# Altium project FlightController.PrjPcb (part 2 of 2)

## Sheet NRF24l01.SchDoc
size A2; SheetNumber: 5; SheetTotal: 13
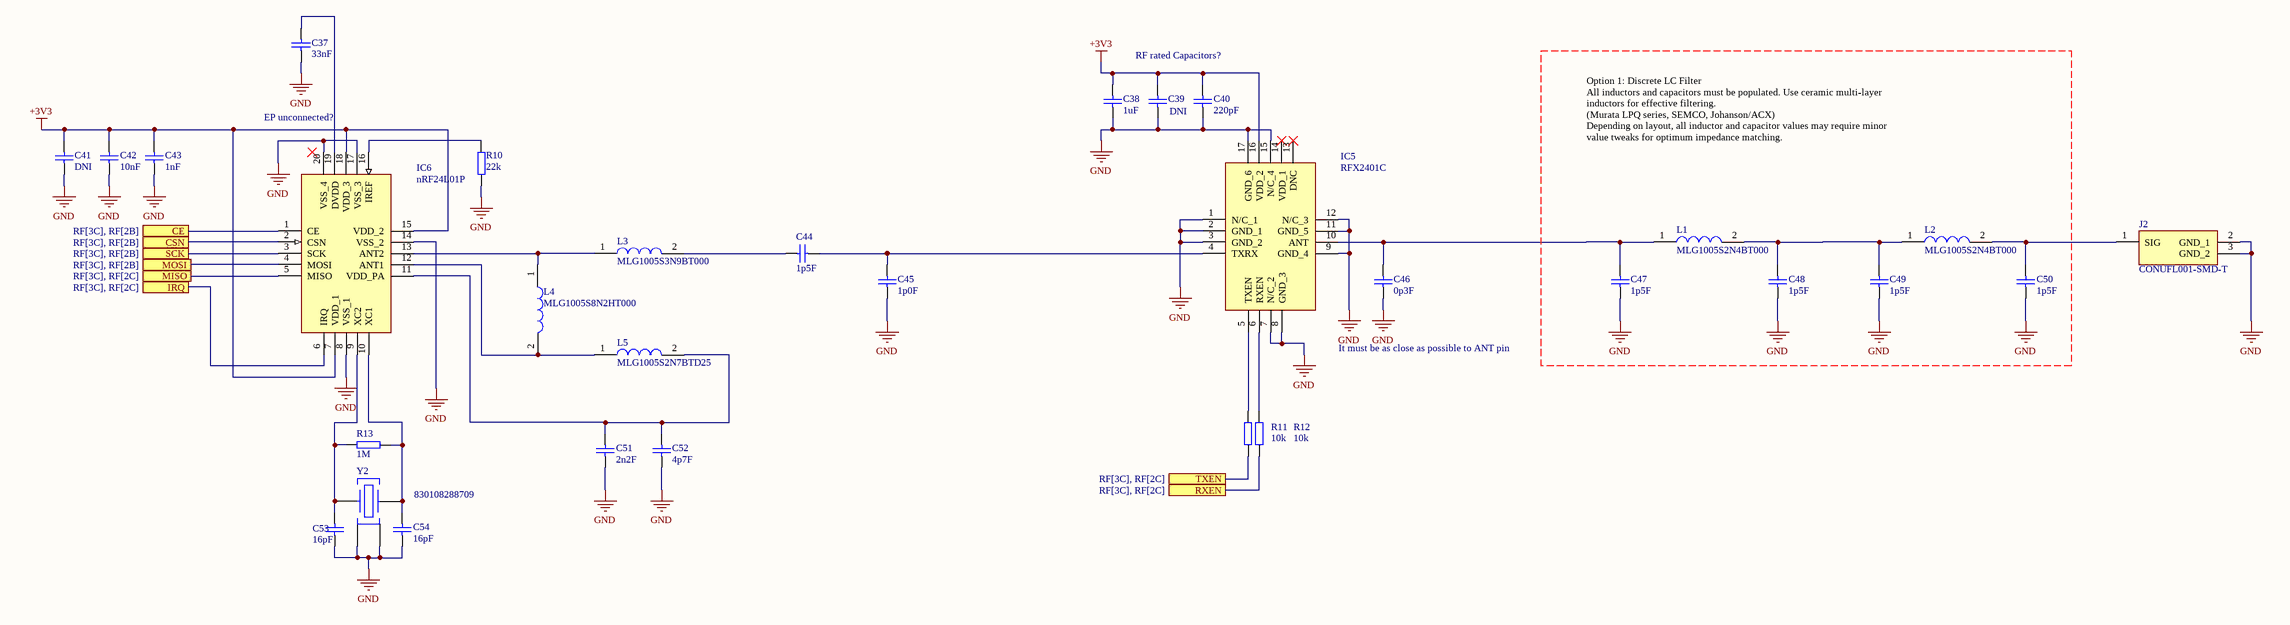
[diagram p11: NRF24l01.SchDoc]

### Parts
C37  value 33nF  [CAP0402]  (hidden comment: Cap0402)
C38  value 1uF  [CAP0402]  (hidden comment: Cap0402)
C39  value DNI  [CAP0402]  (hidden comment: Cap0402)
C40  value 220pF  [CAP0402]  (hidden comment: Cap0402)
C41  value DNI  [CAP0402]  (hidden comment: Cap0402)
C42  value 10nF  [CAP0402]  (hidden comment: Cap0402)
C43  value 1nF  [CAP0402]  (hidden comment: Cap0402)
C44  value 1p5F  [CAP0402]  (hidden comment: Cap0402)
C45  value 1p0F  [CAP0402]  (hidden comment: Cap0402)
C46  value 0p3F  [CAP0402]  (hidden comment: Cap0402)
C47  value 1p5F  [CAP0402]  (hidden comment: Cap0402)
C48  value 1p5F  [CAP0402]  (hidden comment: Cap0402)
C49  value 1p5F  [CAP0402]  (hidden comment: Cap0402)
C50  value 1p5F  [CAP0402]  (hidden comment: Cap0402)
C51  value 2n2F  [CAP0402]  (hidden comment: Cap0402)
C52  value 4p7F  [CAP0402]  (hidden comment: Cap0402)
C53  value 16pF  [CAP0402]  (hidden comment: Cap0402)
C54  value 16pF  [CAP0402]  (hidden comment: Cap0402)
IC5  RFX2401C  [QFN50P300X300X60-17N-D]
IC6  nRF24L01P  [QFN50P400X400X95-21N-D]
J2  CONUFL001-SMD-T  [CONUFL001-SMD]
L1  MLG1005S2N4BT000  [MLG1005]
L2  MLG1005S2N4BT000  [MLG1005]
L3  MLG1005S3N9BT000  [MLG1005]
L4  MLG1005S8N2HT000  [MLG1005]
L5  MLG1005S2N7BTD25  [MLG1005]
R10  value 22k  [RES0402]  (hidden comment: Res0402)
R11  value 10k  [RES0402]  (hidden comment: Res0402)
R12  value 10k  [RES0402]  (hidden comment: Res0402)
R13  value 1M  [RES0402]  (hidden comment: Res0402)
Y2  830108288709  [830108288709]

### Ports
CE (see RF[3C], RF[2B]), CSN (see RF[3C], RF[2B]), IRQ (see RF[3C], RF[2C]), MISO (see RF[3C], RF[2C]), MOSI (see RF[3C], RF[2B]), RXEN (see RF[3C], RF[2C]), SCK (see RF[3C], RF[2B]), TXEN (see RF[3C], RF[2C])

### Nets
+3V3: C38.2 C39.2 C40.2 C41.2 C42.2 C43.2 IC5.16(VDD_2) IC6.7(VDD_1) IC6.15(VDD_2) IC6.18(VDD_3)
GND: C37.1 C38.1 C39.1 C40.1 C41.1 C42.1 C43.1 C45.1 C46.1 C47.1 C48.1 C49.1 C50.1 C51.1 C52.1 C53.1 C54.1 IC5.1(N/C_1) IC5.2(GND_1) IC5.3(GND_2) IC5.7(N/C_2) IC5.8(GND_3) IC5.9(GND_4) IC5.11(GND_5) IC5.12(N/C_3) IC5.15(N/C_4) IC5.17(GND_6) IC6.8(VSS_1) IC6.14(VSS_2) IC6.17(VSS_3) IC6.20(VSS_4) J2.2(GND_1) J2.3(GND_2) R10.1 Y2.2(GND_1) Y2.4(GND_2)
NetC37_2: C37.2 IC6.19(DVDD)
NetC44_1: C44.1 C45.2 IC5.4(TXRX)
NetC44_2: C44.2 L3.2
NetC46_2: C46.2 C47.2 IC5.10(ANT) L1.1
NetC48_2: C48.2 C49.2 L1.2 L2.1
NetC50_2: C50.2 J2.1(SIG) L2.2
NetC51_2: C51.2 C52.2 IC6.11(VDD_PA) L5.2
NetC53_2: C53.2 IC6.9(XC2) R13.1 Y2.1(CRYSTAL_1)
NetC54_2: C54.2 IC6.10(XC1) R13.2 Y2.3(CRYSTAL_2)
NetIC5_5: IC5.5(TXEN) R11.2
NetIC5_6: IC5.6(RXEN) R12.2
NetIC6_1: IC6.1(CE) ; port CE
NetIC6_2: IC6.2(CSN) ; port CSN
NetIC6_3: IC6.3(SCK) ; port SCK
NetIC6_4: IC6.4(MOSI) ; port MOSI
NetIC6_5: IC6.5(MISO) ; port MISO
NetIC6_6: IC6.6(IRQ) ; port IRQ
NetIC6_12: IC6.12(ANT1) L4.2 L5.1
NetIC6_13: IC6.13(ANT2) L3.1 L4.1
NetIC6_16: IC6.16(IREF) R10.2
NetR11_1: R11.1 ; port TXEN
NetR12_1: R12.1 ; port RXEN

Not connected (* = marked no-connect by the designer): IC5 13(DNC)* 14(VDD_1)*

### Notes on the sheet
- RF rated Capacitors?
- EP unconnected?
- Option 1: Discrete LC Filter
  All inductors and capacitors must be populated. Use ceramic multi-layer
  inductors for effective filtering.
  (Murata LPQ series, SEMCO, Johanson/ACX)
  Depending on layout, all inductor and capacitor values may require minor
  value tweaks for optimum impedance matching.
- It must be as close as possible to ANT pin

### Library data of the parts
C37 = Cap0402: Manufacturer_Part_Number: GRM155R61H333KE14D; Voltage: 6V3
C38 = Cap0402: Manufacturer_Part_Number: GRM155R61H105KE05J; Voltage: 6V3
C39 C41 = Cap0402: Voltage: 6V3
C40 = Cap0402: Manufacturer_Part_Number: GRM1555C1H221JA01D; Voltage: 6V3
C42 = Cap0402: Manufacturer_Part_Number: GRM155R71H103MA88D; Voltage: 6V3
C43 = Cap0402: Manufacturer_Part_Number: GRM155R71H102KA01J; Voltage: 6V3
C44 C47-C50 = Cap0402: RF NP0; Manufacturer_Part_Number: GRM1555C1H1R5BA01J; Voltage: 6V3
C45 = Cap0402: RF NP0; Manufacturer_Part_Number: GCM1555C1H1R0BA16D; Voltage: 6V3
C46 = Cap0402: RF NP0; Manufacturer_Part_Number: GJM1555C1HR30BB01J; Voltage: 6V3
C51 = Cap0402: RF NP0; Manufacturer_Part_Number: GRM1555C1H222GA01D; Voltage: 6V3
C52 = Cap0402: RF NP0; Manufacturer_Part_Number: GJM1555C1H4R7CB01D; Voltage: 6V3
C53 C54 = Cap0402: NP0; Manufacturer_Part_Number: GRT1555C1H160FA02D; Voltage: 6V3
IC5 = RFX2401C: Integrated Circuit; Manufacturer_Name: Skyworks; Datasheet Link: https://eu.mouser.com/datasheet/2/472/RFX2401C_204359B-1524606.pdf; Height: 0.6mm; Manufacturer_Part_Number: RFX2401C; Arrow Part Number: RFX2401C; Arrow Price/Stock: https://www.arrow.com/en/products/rfx2401c/skyworks-solutions?region=nac
IC6 = nRF24L01P: Integrated Circuit; Manufacturer_Name: Nordic Semiconductor; Height: 0.95mm; Manufacturer_Part_Number: nRF24L01P
J2 = CONUFL001-SMD-T: Connector; Manufacturer_Name: Linx Technologies; Datasheet Link: https://linxtechnologies.com/wp/product/mhf-rf-connectors/; Manufacturer_Part_Number: CONUFL001-SMD-T; Mouser Part Number: 712-CONUFL001-SMD-T; Mouser Price/Stock: https://www.mouser.co.uk/ProductDetail/Linx-Technologies/CONUFL001-SMD-T?qs=EU6FO9ffTwfRdkBeQTdJWQ%3D%3D
L1 L2 = MLG1005S2N4BT000: Inductor; Manufacturer_Name: TDK; Datasheet Link: https://product.tdk.com/system/files/dam/doc/product/inductor/inductor/smd/catalog/inductor_commercial_high-frequency_mlg1005s_en.pdf; Manufacturer_Part_Number: MLG1005S2N4BT000; Arrow Part Number: MLG1005S2N4BT000; Arrow Price/Stock: https://www.arrow.com/en/products/mlg1005s2n4bt000/tdk
L3 = MLG1005S3N9BT000: Inductor; Manufacturer_Name: TDK; Datasheet Link: https://product.tdk.com/system/files/dam/doc/product/inductor/inductor/smd/catalog/inductor_commercial_high-frequency_mlg1005s_en.pdf; Manufacturer_Part_Number: MLG1005S3N9BT000; Arrow Part Number: MLG1005S3N9BT000; Arrow Price/Stock: https://www.arrow.com/en/products/mlg1005s3n9bt000/tdk
L4 = MLG1005S8N2HT000: Inductor; Manufacturer_Name: TDK; Datasheet Link: https://product.tdk.com/system/files/dam/doc/product/inductor/inductor/smd/catalog/inductor_commercial_high-frequency_mlg1005s_en.pdf; Manufacturer_Part_Number: MLG1005S8N2HT000
L5 = MLG1005S2N7BTD25: Inductor; Manufacturer_Name: TDK; Datasheet Link: https://product.tdk.com/system/files/dam/doc/product/inductor/inductor/smd/catalog/inductor_automotive_high-frequency_mlg1005s_en.pdf; Manufacturer_Part_Number: MLG1005S2N7BTD25
R10 = Res0402: Manufacturer_Part_Number: RC0402JR-13100KL
R11 R12 = Res0402: Manufacturer_Part_Number: ERA-2AED103X
R13 = Res0402: Manufacturer_Part_Number: RK73H1ETTP1004F
Y2 = 830108288709: Crystal or Oscillator; Manufacturer_Name: Wurth Elektronik; Datasheet Link: https://www.we-online.com/catalog/datasheet/830108340709.pdf; Height: 0.5mm; Manufacturer_Part_Number: 830108288709

## Nets that join several sheets
+3V3: MCU (31 pins), IMU (19 pins), Flash (C77.2 IC8.8 R18.2), GPS (7 pins), Barometer (7 pins), LED (8 pins), PB_Conn (R25.2), PSU (C71.2 C72.2 C73.2 FL2.2), Temp (C96.2 IC11.3), NRF24l01 (10 pins)
GND: MCU (46 pins), IMU (29 pins), Flash (C77.1 IC8.4), GPS (18 pins), Barometer (6 pins), LED (12 pins), PB_Conn (D10.2 D11.2 J10.48 J10.49), PSU (23 pins), Temp (C96.1 IC11.6 IC11.9), NRF24l01 (36 pins)
NetC56_1: PB_Conn (D10.1 J10.46 J10.47), PSU (C56.1 C60.2 FL1.1)
NetC84_2: MCU (IC4.57), GPS (C84.2 IC9.2)
NetC85_2: MCU (IC4.56), GPS (C85.2 IC9.3)
NetD6_3: MCU (IC4.5), LED (D6.3)
NetIC1_4: MCU (IC4.117), IMU (IC1.4)
NetIC1_9: MCU (IC4.119), IMU (IC1.9 IC2.9 IC3.7)
NetIC1_12: MCU (IC4.125), IMU (IC1.12 R1.1)
NetIC2_4: MCU (IC4.40), IMU (IC2.4)
NetIC2_12: MCU (IC4.44), IMU (IC2.12)
NetIC3_1: MCU (IC4.22), IMU (IC3.1)
NetIC3_2: MCU (IC4.18), IMU (IC3.2)
NetIC4_10: MCU (IC4.10), PB_Conn (J10.23)
NetIC4_11: MCU (IC4.11), PB_Conn (J10.25)
NetIC4_12: MCU (IC4.12), PB_Conn (J10.27)
NetIC4_28: MCU (IC4.28), PB_Conn (J10.37)
NetIC4_29: MCU (IC4.29), PB_Conn (J10.38)
NetIC4_34: MCU (IC4.34), PB_Conn (J10.30)
NetIC4_35: MCU (IC4.35), PB_Conn (J10.32)
NetIC4_36: MCU (IC4.36), PB_Conn (J10.34)
NetIC4_37: MCU (IC4.37), Flash (IC8.3)
NetIC4_42: MCU (IC4.42), Flash (IC8.7)
NetIC4_45: MCU (IC4.45), PB_Conn (J10.36)
NetIC4_46: MCU (IC4.46), Flash (IC8.2)
NetIC4_47: MCU (IC4.47), Flash (IC8.5)
NetIC4_48: MCU (IC4.48), Flash (IC8.6)
NetIC4_49: MCU (IC4.49), GPS (IC9.9)
NetIC4_50: MCU (IC4.50), GPS (IC9.5)
NetIC4_53: MCU (IC4.53), PB_Conn (J10.40)
NetIC4_54: MCU (IC4.54), Barometer (IC10.2 R20.1), Temp (IC11.5)
NetIC4_55: MCU (IC4.55), Barometer (IC10.4 R19.1), Temp (IC11.4)
NetIC4_58: MCU (IC4.58), PB_Conn (J10.35)
NetIC4_59: MCU (IC4.59), PB_Conn (J10.33)
NetIC4_60: MCU (IC4.60), PB_Conn (J10.31)
NetIC4_63: MCU (IC4.63), PB_Conn (J10.29)
NetIC4_64: MCU (IC4.64), Flash (IC8.1 R18.1)
NetIC4_65: MCU (IC4.65), PB_Conn (J10.28)
NetIC4_66: MCU (IC4.66), PB_Conn (J10.26)
NetIC4_67: MCU (IC4.67), PB_Conn (J10.24)
NetIC4_68: MCU (IC4.68), PB_Conn (J10.22)
NetIC4_69: MCU (IC4.69), PB_Conn (J10.12)
NetIC4_70: MCU (IC4.70), PB_Conn (J10.13)
NetIC4_73: MCU (IC4.73), PB_Conn (J10.21)
NetIC4_74: MCU (IC4.74), PB_Conn (J10.39)
NetIC4_75: MCU (IC4.75), Barometer (IC10.7)
NetIC4_76: MCU (IC4.76), PB_Conn (J10.16)
NetIC4_77: MCU (IC4.77), PB_Conn (J10.18)
NetIC4_78: MCU (IC4.78), PB_Conn (J10.11)
NetIC4_79: MCU (IC4.79), PB_Conn (J10.20)
NetIC4_80: MCU (IC4.80), PB_Conn (J10.8)
NetIC4_81: MCU (IC4.81), PB_Conn (J10.19)
NetIC4_82: MCU (IC4.82), PB_Conn (J10.17)
NetIC4_85: MCU (IC4.85), PB_Conn (J10.15)
NetIC4_86: MCU (IC4.86), PB_Conn (J10.1)
NetIC4_87: MCU (IC4.87), PB_Conn (J10.14)
NetIC4_88: MCU (IC4.88), PB_Conn (J10.2)
NetIC4_89: MCU (IC4.89), PB_Conn (J10.4)
NetIC4_90: MCU (IC4.90), PB_Conn (J10.6)
NetIC4_92: MCU (IC4.92), PB_Conn (J10.10)
NetIC4_93: MCU (IC4.93), PB_Conn (J10.9)
NetIC4_96: MCU (IC4.96), PB_Conn (J10.7)
NetIC4_97: MCU (IC4.97), PB_Conn (J10.5)
NetIC4_98: MCU (IC4.98), PB_Conn (J10.3)
NetIC4_99: MCU (IC4.99), LED (R24.1)
NetIC4_100: MCU (IC4.100), LED (R23.1)
NetIC4_101: MCU (IC4.101), LED (R22.1)
NetIC4_102: MCU (IC4.102), LED (R21.1)
NetIC4_103: MCU (IC4.103), PB_Conn (J10.41)
NetIC4_104: MCU (IC4.104), PB_Conn (J10.42)
SPI1_MISO: MCU (IC4.134), IMU (IC1.1)
SPI1_MOSI: MCU (IC4.123), IMU (IC1.14)
SPI1_SCK: MCU (IC4.126), IMU (IC1.13)
SPI5_MISO: MCU (IC4.20), IMU (IC3.6)
SPI5_MOSI: MCU (IC4.21), IMU (IC3.5)
SPI5_SCK: MCU (IC4.19), IMU (IC3.3)
SPI6_MISO: MCU (IC4.127), IMU (IC2.1)
SPI6_MOSI: MCU (IC4.43), IMU (IC2.14)
SPI6_SCK: MCU (IC4.41), IMU (IC2.13)